# EAGLE schematic tb6560openhw (EAGLE 6.4)
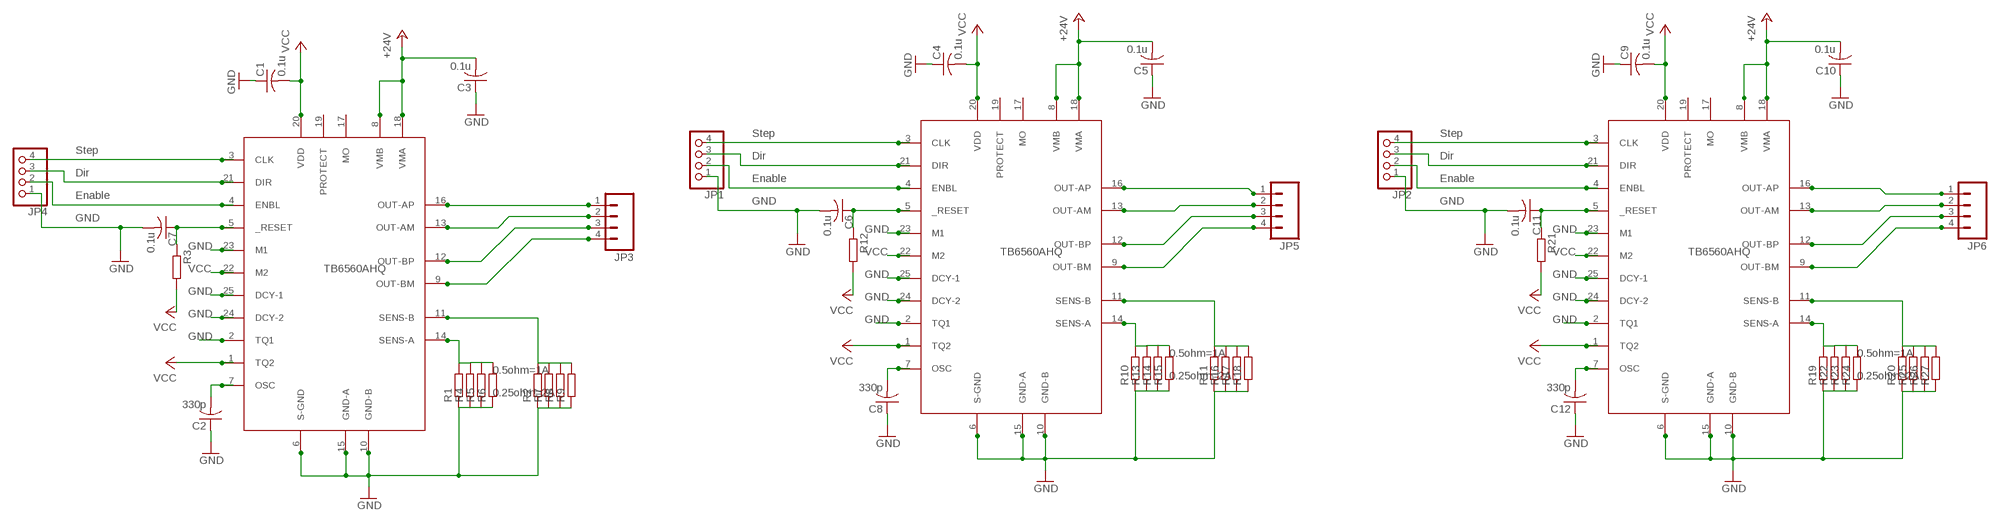
[diagram p0: schematic, sheet 1]

## Parts
C1  0.1u  C-USC1206K  [C1206K]
C2  330p  C-USC1206K  [C1206K]
C3  0.1u  C-USC1206K  [C1206K]
C4  0.1u  C-USC1206K  [C1206K]
C5  0.1u  C-USC1206K  [C1206K]
C6  0.1u  C-USC1206K  [C1206K]
C7  0.1u  C-USC1206K  [C1206K]
C8  330p  C-USC1206K  [C1206K]
C9  0.1u  C-USC1206K  [C1206K]
C10  0.1u  C-USC1206K  [C1206K]
C11  0.1u  C-USC1206K  [C1206K]
C12  330p  C-USC1206K  [C1206K]
JP1  PINHD-1X4  [1X04]
JP2  PINHD-1X4  [1X04]
JP3  M04SCREW  [SCREWTERMINAL-3.5MM-4]
JP4  PINHD-1X4  [1X04]
JP5  M04SCREW  [SCREWTERMINAL-3.5MM-4]
JP6  M04SCREW  [SCREWTERMINAL-3.5MM-4]
R1  R-EU_0411/3V  [0411V]
R2  R-EU_0411/3V  [0411V]
R3  R-EU_0207/10  [0207/10]
R4  R-EU_0411/3V  [0411V]
R5  R-EU_0411/3V  [0411V]
R6  R-EU_0411/3V  [0411V]
R7  R-EU_0411/3V  [0411V]
R8  R-EU_0411/3V  [0411V]
R9  R-EU_0411/3V  [0411V]
R10  R-EU_0411/3V  [0411V]
R11  R-EU_0411/3V  [0411V]
R12  R-EU_0207/10  [0207/10]
R13  R-EU_0411/3V  [0411V]
R14  R-EU_0411/3V  [0411V]
R15  R-EU_0411/3V  [0411V]
R16  R-EU_0411/3V  [0411V]
R17  R-EU_0411/3V  [0411V]
R18  R-EU_0411/3V  [0411V]
R19  R-EU_0411/3V  [0411V]
R20  R-EU_0411/3V  [0411V]
R21  R-EU_0207/10  [0207/10]
R22  R-EU_0411/3V  [0411V]
R23  R-EU_0411/3V  [0411V]
R24  R-EU_0411/3V  [0411V]
R25  R-EU_0411/3V  [0411V]
R26  R-EU_0411/3V  [0411V]
R27  R-EU_0411/3V  [0411V]
U$1  TB6560-H  [ZIP25-H]
U$2  TB6560-H  [ZIP25-H]
U$3  TB6560-H  [ZIP25-H]

## Nets
+24V: C3.2 C5.2 C10.2 U$1.8(VMB) U$1.18(VMA) U$2.8(VMB) U$2.18(VMA) U$3.8(VMB) U$3.18(VMA)
ENABLE: JP1.2 JP2.2 JP4.2 U$1.4(ENBL) U$2.4(ENBL) U$3.4(ENBL)
GND: C1.1 C2.1 C3.1 C4.1 C5.1 C6.2 C7.2 C8.1 C9.1 C10.1 C11.2 C12.1 JP1.1 JP2.1 JP4.1 R1.1 R2.1 R4.1 R5.1 R6.1 R7.1 R8.1 R9.1 R10.1 R11.1 R13.1 R14.1 R15.1 R16.1 R17.1 R18.1 R19.1 R20.1 R22.1 R23.1 R24.1 R25.1 R26.1 R27.1 U$1.2(TQ1) U$1.6(S-GND) U$1.10(GND-B) U$1.15(GND-A) U$1.23(M1) U$1.24(DCY-2) U$1.25(DCY-1) U$2.2(TQ1) U$2.6(S-GND) U$2.10(GND-B) U$2.15(GND-A) U$2.23(M1) U$2.24(DCY-2) U$2.25(DCY-1) U$3.2(TQ1) U$3.6(S-GND) U$3.10(GND-B) U$3.15(GND-A) U$3.23(M1) U$3.24(DCY-2) U$3.25(DCY-1)
N$1: R1.2 R4.2 R5.2 R6.2 U$1.14(SENS-A)
N$2: R2.2 R7.2 R8.2 R9.2 U$1.11(SENS-B)
N$3: JP3.1 U$1.16(OUT-AP)
N$4: JP3.3 U$1.12(OUT-BP)
N$5: JP3.2 U$1.13(OUT-AM)
N$6: JP3.4 U$1.9(OUT-BM)
N$7: R10.2 R13.2 R14.2 R15.2 U$2.14(SENS-A)
N$8: R11.2 R16.2 R17.2 R18.2 U$2.11(SENS-B)
N$9: JP5.1 U$2.16(OUT-AP)
N$10: C8.2 U$2.7(OSC)
N$11: R19.2 R22.2 R23.2 R24.2 U$3.14(SENS-A)
N$12: R20.2 R25.2 R26.2 R27.2 U$3.11(SENS-B)
N$13: C2.2 U$1.7(OSC)
N$15: C6.1 R12.1 U$2.5(_RESET)
N$16: JP5.3 U$2.12(OUT-BP)
N$17: JP5.2 U$2.13(OUT-AM)
N$18: JP5.4 U$2.9(OUT-BM)
N$19: JP6.1 U$3.16(OUT-AP)
N$20: C12.2 U$3.7(OSC)
N$22: C11.1 R21.1 U$3.5(_RESET)
N$23: JP6.3 U$3.12(OUT-BP)
N$25: C7.1 R3.1 U$1.5(_RESET)
N$26: JP6.2 U$3.13(OUT-AM)
N$27: JP6.4 U$3.9(OUT-BM)
VCC: C1.2 C4.2 C9.2 R3.2 R12.2 R21.2 U$1.1(TQ2) U$1.20(VDD) U$1.22(M2) U$2.1(TQ2) U$2.20(VDD) U$2.22(M2) U$3.1(TQ2) U$3.20(VDD) U$3.22(M2)
XDIR: JP4.3 U$1.21(DIR)
XSTEP: JP4.4 U$1.3(CLK)
YDIR: JP1.3 U$2.21(DIR)
YSTEP: JP1.4 U$2.3(CLK)
ZDIR: JP2.3 U$3.21(DIR)
ZSTEP: JP2.4 U$3.3(CLK)
Unconnected: U$1.17(MO) U$1.19(PROTECT) U$2.17(MO) U$2.19(PROTECT) U$3.17(MO) U$3.19(PROTECT)

## Notes on the sheet
- Step | Step
- Step
- Dir | Dir
- Dir
- Enable | Enable
- Enable
- GND | GND
- GND
- TB6560AHQ | TB6560AHQ
- TB6560AHQ
- 0.5ohm=1A | 0.5ohm=1A
- 0.5ohm=1A
- 0.25ohm=2A | 0.25ohm=2A
- 0.25ohm=2A

## Library data of the parts
C1-C12 = adafruit:C-US: CAPACITOR, American symbol
JP1 JP2 JP4 = pinhead:PINHD-1X4: PIN HEADER
JP3 JP5 JP6 = SparkFun-Connectors:M04: Header 4 Standard 4-pin 0.1" header. Use with straight break away headers (SKU : PRT-00116), right angle break away headers (PRT-00553), swiss pins (PRT-00743), machine pins (PRT-00117), and female headers (PRT-00115). Molex polarized connector foot print use with SKU : PRT-08231 with associated crimp pins and housings. 1MM SMD Version SKU: PRT-10208
R1 R2 R4-R11 R13-R20 R22-R27 = CNC-Components:R-EU_: RESISTOR, European symbol
R3 R12 R21 = rcl:R-EU_: RESISTOR, European symbol
U$1-U$3 = tb6560:TB6560-H

## Net classes
0 default: clearance 0.635 mm